# Altium schematic sheet interface.SchDoc
size A4
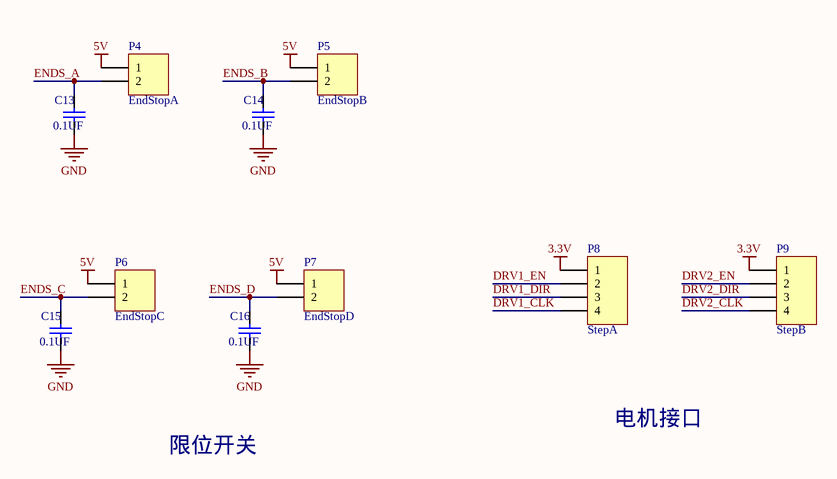
[diagram p0: interface.SchDoc]

## Parts
C13  0.1UF  [0603(1608)]
C14  0.1UF  [0603(1608)]
C15  0.1UF  [0603(1608)]
C16  0.1UF  [0603(1608)]
P4  EndStopA  [XH2.54_2PIN]
P5  EndStopB  [XH2.54_2PIN]
P6  EndStopC  [XH2.54_2PIN]
P7  EndStopD  [XH2.54_2PIN]
P8  StepA  [XH2.54_4PIN]
P9  StepB  [XH2.54_4PIN]

## Nets
3.3V: P8.1 P9.1
5V: P4.1 P5.1 P6.1 P7.1
GND: C13.2 C14.2 C15.2 C16.2
DRV1_CLK: P8.4
DRV1_DIR: P8.3
DRV1_EN: P8.2
DRV2_CLK: P9.4
DRV2_DIR: P9.3
DRV2_EN: P9.2
ENDS_A: C13.1 P4.2
ENDS_B: C14.1 P5.2
ENDS_C: C15.1 P6.2
ENDS_D: C16.1 P7.2

## Notes on the sheet
- 限位开关
- 电机接口

## Library data of the parts
C13-C16 = Cap: Capacitor; Published: 8-Jun-2000; LatestRevisionDate: 17-Jul-2002; LatestRevisionNote: Re-released for DXP Platform.; PackageReference: RAD-0.3; Publisher: Altium Limited
P4-P7 = Header 2: Header, 2-Pin; LatestRevisionDate: 17-Jul-2002; LatestRevisionNote: Re-released for DXP Platform.; Publisher: Altium Limited
P8 P9 = Header 4: Header, 4-Pin; LatestRevisionDate: 17-Jul-2002; LatestRevisionNote: Re-released for DXP Platform.; Publisher: Altium Limited